# EasyEDA Pro project 小张FOC-STM32G431CBU6.epro, schematic Schematic1
Board Name: 主驱一体_V1.1; Create Date: 2024-09-16; Page Name: P1; Project Name: 小张FOC-STM32G431CBU6; Schematic Name: Schematic1; Update Date: 2024-11-04; Company: 嘉立创EDA; Page Size: A3; Version: V1.0
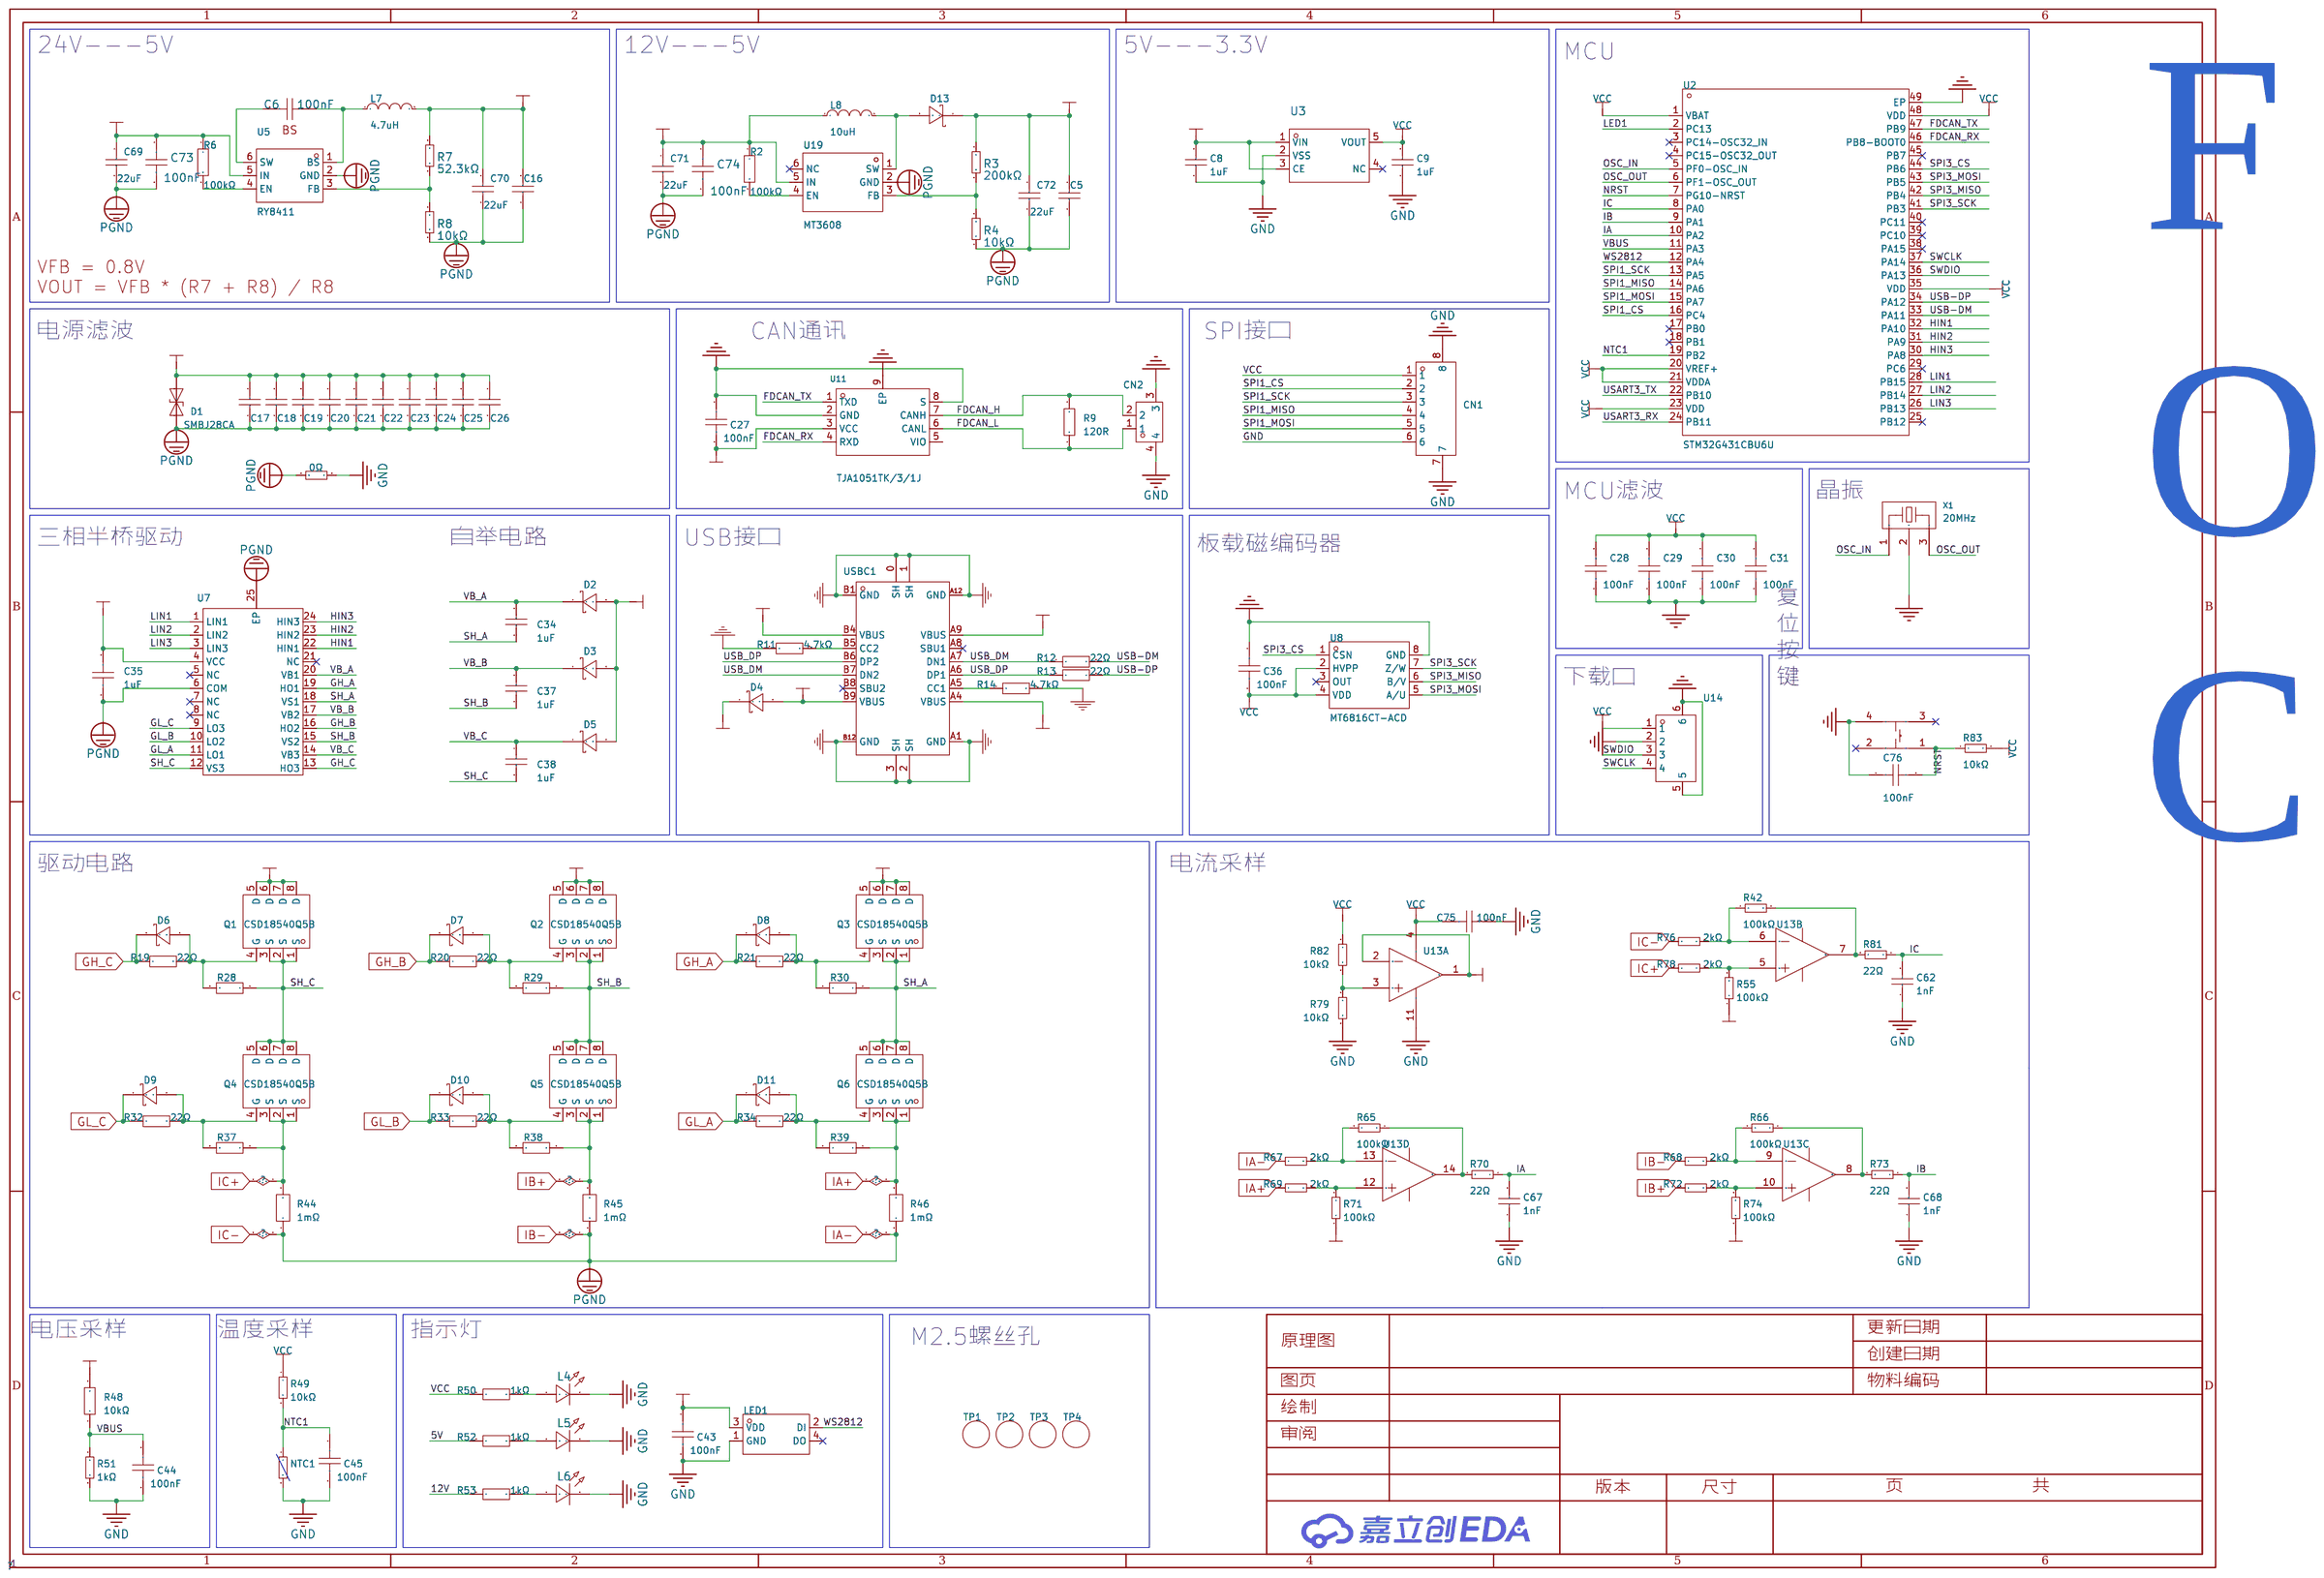
[diagram p4: schematic sheet]

## Parts
C5  100nF  [C0603_SMALL]
C6  100nF  [C0603_SMALL]
C8  1uF  [C0603_SMALL]
C9  1uF  [C0603_SMALL]
C16  100nF  [C0603_SMALL]
C17  10uF  [C1206_SMALL]
C18  10uF  [C1206_SMALL]
C19  10uF  [C1206_SMALL]
C20  10uF  [C1206_SMALL]
C21  10uF  [C1206_SMALL]
C22  10uF  [C1206_SMALL]
C23  10uF  [C1206_SMALL]
C24  10uF  [C1206_SMALL]
C25  10uF  [C1206_SMALL]
C26  10uF  [C1206_SMALL]
C27  100nF  [C0603_SMALL]
C28  100nF  [C0603_SMALL]
C29  100nF  [C0603_SMALL]
C30  100nF  [C0603_SMALL]
C31  100nF  [C0603_SMALL]
C34  1uF  [C0603_SMALL]
C35  1uF  [C0805_SMALL]
C36  100nF  [C0603_SMALL]
C37  1uF  [C0603_SMALL]
C38  1uF  [C0603_SMALL]
C43  100nF  [C0603_SMALL]
C44  100nF  [C0603_SMALL]
C45  100nF  [C0603_SMALL]
C62  1nF  [C0603_S]
C67  1nF  [C0603_S]
C68  1nF  [C0603_S]
C69  22uF  [C1206_SMALL]
C70  22uF  [C1206_SMALL]
C71  22uF  [C1206_SMALL]
C72  22uF  [C1206_SMALL]
C73  100nF  [C0603_SMALL]
C74  100nF  [C0603_SMALL]
C75  100nF  [C0603_SMALL]
C76  100nF  [C0603_SMALL]
CN1  WAFER-GH1.25-6PWB  [CONN-SMD_6P-P1.25_XUNPU_WAFER-GH1.25-6PWB]
CN2  X1251WRS-02HF-LPSW  [CONN-SMD_2P-P1.25_X1251WRS-02HF-LPSW]
D1  SMBJ28CA  [SMB_L4.6-W3.6-LS5.3-BI]
D2  B16WS  [SOD-323_L1.8-W1.3-LS2.5-RD]
D3  B16WS  [SOD-323_L1.8-W1.3-LS2.5-RD]
D4  B16WS  [SOD-323_L1.8-W1.3-LS2.5-RD]
D5  B16WS  [SOD-323_L1.8-W1.3-LS2.5-RD]
D6  B16WS  [SOD-323_L1.8-W1.3-LS2.5-RD]
D7  B16WS  [SOD-323_L1.8-W1.3-LS2.5-RD]
D8  B16WS  [SOD-323_L1.8-W1.3-LS2.5-RD]
D9  B16WS  [SOD-323_L1.8-W1.3-LS2.5-RD]
D10  B16WS  [SOD-323_L1.8-W1.3-LS2.5-RD]
D11  B16WS  [SOD-323_L1.8-W1.3-LS2.5-RD]
D13  B16WS  [SOD-323_L1.8-W1.3-LS2.5-RD]
L4  NCD0603R1  [LED0603_S]
L5  NCD0603R1  [LED0603_S]
L6  NCD0603R1  [LED0603_S]
L7  4.7uH  [IND-SMD_L4.0-W4.0_FNR40XXS]
L8  10uH  [IND-SMD_L4.0-W4.0_FNR40XXS]
LED1  XL-3528RGBW-WS2812B  [LED-SMD_4P-L3.5-W2.8-BR-1]
NTC1  NCP18XH103F03RB  [R0603_SMALL]
Q1  CSD18540Q5B  [VSON-CLIP-8_L5.0-W6.0-P1.27-BL]
Q2  CSD18540Q5B  [VSON-CLIP-8_L5.0-W6.0-P1.27-BL]
Q3  CSD18540Q5B  [VSON-CLIP-8_L5.0-W6.0-P1.27-BL]
Q4  CSD18540Q5B  [VSON-CLIP-8_L5.0-W6.0-P1.27-BL]
Q5  CSD18540Q5B  [VSON-CLIP-8_L5.0-W6.0-P1.27-BL]
Q6  CSD18540Q5B  [VSON-CLIP-8_L5.0-W6.0-P1.27-BL]
R2  100kΩ  [R0603_SMALL]
R3  200kΩ  [R0603_SMALL]
R4  10kΩ  [R0603_SMALL]
R6  100kΩ  [R0603_SMALL]
R7  52.3kΩ  [R0603_SMALL]
R8  10kΩ  [R0603_SMALL]
R9  120R  [R0603_SMALL]
R10  0Ω  [R0603_SMALL]
R11  4.7kΩ  [R0603_SMALL]
R12  22Ω  [R0603_SMALL]
R13  22Ω  [R0603_SMALL]
R14  4.7kΩ  [R0603_SMALL]
R19  22Ω  [R0603_SMALL]
R20  22Ω  [R0603_SMALL]
R21  22Ω  [R0603_SMALL]
R28  10kΩ  [R0603_SMALL]
R29  10kΩ  [R0603_SMALL]
R30  10kΩ  [R0603_SMALL]
R32  22Ω  [R0603_SMALL]
R33  22Ω  [R0603_SMALL]
R34  22Ω  [R0603_SMALL]
R37  10kΩ  [R0603_SMALL]
R38  10kΩ  [R0603_SMALL]
R39  10kΩ  [R0603_SMALL]
R42  100kΩ  [R0603_S]
R44  1mΩ  [RES-SMD_L6.4-W3.2_LR2512D-3W-1MR]
R45  1mΩ  [RES-SMD_L6.4-W3.2_LR2512D-3W-1MR]
R46  1mΩ  [RES-SMD_L6.4-W3.2_LR2512D-3W-1MR]
R48  10kΩ  [R0603_SMALL]
R49  10kΩ  [R0603_SMALL]
R50  1kΩ  [R0603_SMALL]
R51  1kΩ  [R0603_SMALL]
R52  1kΩ  [R0603_SMALL]
R53  1kΩ  [R0603_SMALL]
R55  100kΩ  [R0603_S]
R65  100kΩ  [R0603_S]
R66  100kΩ  [R0603_S]
R67  2kΩ  [R0603_S]
R68  2kΩ  [R0603_S]
R69  2kΩ  [R0603_S]
R70  22Ω  [R0603_S]
R71  100kΩ  [R0603_S]
R72  2kΩ  [R0603_S]
R73  22Ω  [R0603_S]
R74  100kΩ  [R0603_S]
R76  2kΩ  [R0603_S]
R78  2kΩ  [R0603_S]
R79  10kΩ  [R0603_S]
R81  22Ω  [R0603_S]
R82  10kΩ  [R0603_S]
R83  10kΩ  [R0603_S]
SW2  SKRPACE010  [KEY-SMD_4P-L4.2-W3.2-P2.20-LS4.6]
TP1  -  [M2.5螺丝孔]
TP2  -  [M2.5螺丝孔]
TP3  -  [M2.5螺丝孔]
TP4  -  [M2.5螺丝孔]
U2  STM32G431CBU6U  [UFQFPN-48_L7.0-W7.0-P0.50-BL-EP5.6]
U3  XC6210B332MR  [SOT-23-5_L3.0-W1.7-P0.95-LS2.8-BR]
U5  RY8411  [SOT-23-6_L2.9-W1.6-P0.95-LS2.8-BL]
U7  FD6288Q  [QFN-24_L4.0-W4.0-P0.50-BL-EP2.6]
U8  MT6816CT-ACD  [SOP-8_L5.0-W4.0-P1.27-LS6.0-BL]
U11  TJA1051TK/3/1J  [HVSON-8_L3.0-W3.0-P0.65-BL-EP]
U13  RS624XQ  [TSSOP-14_L5.0-W4.4-P0.65-LS6.4-BL]  (sections 1,2,3,4)
U14  WAFER-GH1.25-4PWB  [CONN-SMD_4P-P1.25_XUNPU_WAFER-GH1.25-4PWB]
U19  MT3608  [SOT-23-6_L2.9-W1.6-P0.95-LS2.8-BR]
USBC1  TYPE-C-31-M-12  [USB-C_SMD-TYPE-C-31-M-12]
X1  20MHz  [OSC-SMD_3P-L3.2-W1.3-P1.2-L]

## Library data of the parts
C5 C16 = 0603B104K500NT: 容值:100nF;精度:±10%;额定电压:50V;材质(温度系数):X7R;; LCSC Part Name: 100nF ±10% 50V; Supplier Part: C30926; Manufacturer: FH(风华); Supplier Footprint: 0603; JLCPCB Part Class: Extended Part; Datasheet: https://atta.szlcsc.com/upload/public/pdf/source/20200305/C486355_26A10D38EF8C2A5C37091D0039909270.pdf; Supplier: LCSC; Tolerance: ±10%; Voltage Rated: 50V; Temperature Coefficient: X7R; Pin Type: IN; Check: true
C6 C73 C74 = CC0603KRX7R9BB104: 容值:100nF;精度:±10%;额定电压:50V;材质(温度系数):X7R;; LCSC Part Name: 100nF ±10% 50V; Supplier Part: C14663; Manufacturer: YAGEO(国巨); Supplier Footprint: 0603; JLCPCB Part Class: 基础库; Datasheet: https://atta.szlcsc.com/upload/public/pdf/source/20180910/C282072_33301C7F631E79921B82A8DAC6BCC5B3.pdf; Supplier: LCSC; Tolerance: ±10%; Voltage Rated: 50V; Temperature Coefficient: X7R; Check: true
C8 C9 = CL10A106MA8NRNC: 容值:10uF;精度:±20%;额定电压:25V;材质(温度系数):X5R;; LCSC Part Name: 10uF ±20% 25V; Supplier Part: C96446; Manufacturer: SAMSUNG(三星); Supplier Footprint: 0603; JLCPCB Part Class: 基础库; Datasheet: https://atta.szlcsc.com/upload/public/pdf/source/20160218/1457707763339.pdf; Supplier: LCSC; Tolerance: ±20%; Voltage Rated: 25V; Temperature Coefficient: X5R; Pin Type: IN; Check: true
C17-C26 C69-C72 = CL31A106KBHNNNE: 容值:10uF;精度:±10%;额定电压:50V;材质(温度系数):X5R;; LCSC Part Name: 10uF ±10% 50V; Supplier Part: C13585; Manufacturer: SAMSUNG(三星); Supplier Footprint: 1206; JLCPCB Part Class: Basic Part; Datasheet: https://atta.szlcsc.com/upload/public/pdf/source/20160218/1457707763339.pdf; Supplier: LCSC; Tolerance: ±10%; Voltage Rated: 50V; Temperature Coefficient: X5R; Pin Type: IN; 值: 10UF; Check: true
C27-C31 C36 C43-C45 C75 C76 = 0603B104K500NT: 容值:100nF;精度:±10%;额定电压:50V;材质(温度系数):X7R;; LCSC Part Name: 100nF ±10% 50V; Supplier Part: C30926; Manufacturer: FH(风华); Supplier Footprint: 0603; JLCPCB Part Class: Extended Part; Datasheet: https://atta.szlcsc.com/upload/public/pdf/source/20200305/C486355_26A10D38EF8C2A5C37091D0039909270.pdf; Supplier: LCSC; Tolerance: ±10%; Voltage Rated: 50V; Temperature Coefficient: X7R
C34 C37 C38 = C0603_S: Pin Type: IN; Supplier Part: C1604; Check: true
C35 = CL21A106KAYNNNE_C15850: 容值:10uF;精度:±10%;额定电压:25V;材质(温度系数):X5R;; LCSC Part Name: 10uF ±10% 25V; Supplier Part: C15850; Manufacturer: SAMSUNG(三星); Manufacturer Part: CL21A106KAYNNNE; Supplier Footprint: 0805; JLCPCB Part Class: Basic Part; Datasheet: https://atta.szlcsc.com/upload/public/pdf/source/20160103/1457707679302.pdf; Supplier: LCSC; Tolerance: ±10%; Voltage Rated: 25V; Temperature Coefficient: X5R
C62 C67 C68 = 0603B102K500NT: 容值:1nF;精度:±10%;额定电压:50V;材质(温度系数):X7R;; LCSC Part Name: 1nF ±10% 50V; Supplier Part: C44369; Manufacturer: FH(风华); Supplier Footprint: 0603; JLCPCB Part Class: Extended Part; Datasheet: https://atta.szlcsc.com/upload/public/pdf/source/20200305/C486355_26A10D38EF8C2A5C37091D0039909270.pdf; Supplier: LCSC; Tolerance: ±10%; Voltage Rated: 50V; Temperature Coefficient: X7R; Pin Type: IN; Check: true
CN1 = WAFER-GH1.25-6PWB: 参考系列:GH;间距:1.25mm;插针结构:1x6P;排数:1;每排PIN数:6;公母:公型插针;安装方式:卧贴;额定电流:1A;工作温度范围:-25~+85;; LCSC Part Name: GH1.25mm6P卧贴带扣带扣; Supplier Part: C3029381; Manufacturer: XUNPU(讯普); Supplier Footprint: SMD,P=1.25mm; JLCPCB Part Class: ExtendedPart; Datasheet: https://atta.szlcsc.com/upload/public/pdf/source/20220527/CB8773BFB0913C3B8ABD62CB38BA101A.pdf; Supplier: LCSC; Reference Series: GH; Pitch: 1.25mm; Pins Structure: 1x6P; Number of Rows: 1; Number of PINs Per Row: 6; Gender: 公型插针; Mounting Style: 卧贴; Current Rating (Max): 1A; Operating Temperature Range: -25~+85; Check: true
CN2 = X1251WRS-02HF-LPSW: 插针结构:1x2P;间距:1.25mm;安装方式:卧贴;参考系列:GH;总PIN数:2P;排数:1;每排PIN数:2;行距:-;额定电流:1A;触头材质:黄铜;触头镀层:锡;工作温度范围:-;; LCSC Part Name: 1x2P 间距:1.25mm 卧贴 系列:GH; Supplier Part: C388707; Manufacturer: XKB Connection(中国星坤); Supplier Footprint: SMD,P=1.25mm,卧贴; JLCPCB Part Class: 扩展库; Datasheet: https://atta.szlcsc.com/upload/public/pdf/source/20211011/E2F7306AE87519079AD4EC816349A567.pdf; Supplier: LCSC; Pins Structure: 1x2P; Pitch: 1.25mm; Mounting Style: 卧贴; Reference Series: GH; Number of Pins: 2P; Number of Rows: 1; Number of PINs Per Row: 2; Current Rating (Max): 1A; Contact Material: 黄铜; Contact Plating: 锡
D1 = SMBJ28CA: 反向截止电压(Vrwm):28V;最大钳位电压:45.4V;峰值脉冲电流(Ipp)@10/1000us:13.2A;击穿电压:31.1V;; Supplier Part: C356756; Manufacturer: JJW(捷捷微); Supplier Footprint: SMB(DO-214AA); JLCPCB Part Class: 扩展库; Datasheet: https://atta.szlcsc.com/upload/public/pdf/source/20190118/C364661_581AFCFF6ECC065E7F89B606E0837F4E.pdf; Supplier: LCSC; Reverse Stand-Off Voltage (Vrwm): 28V; Maximum Clamping Voltage: 45.4V; Peak Pulse Current (Ipp)@10/1000us: 13.2A; Breakdown Voltage: 31.1V; Reverse Leakage Current (Ir): 1uA; Type: TVS
D2 D3 D5 D13 = B16WS_C364278: 直流反向耐压(Vr):40V;平均整流电流(Io):1A;正向压降(Vf):650mV@1A;; Supplier Part: C364278; Manufacturer: MDD; Supplier Footprint: SOD-323; JLCPCB Part Class: Extended Part; Datasheet: https://atta.szlcsc.com/upload/public/pdf/source/20190125/C364278_08C9E980565605CB111C36D3361AA1D7.pdf; Supplier: LCSC; Reverse Voltage (Vr): 40V; Average Rectified Current (Io): 1A; Forward Voltage (Vf@If): 650mV@1A; Check: true
D4 D6-D11 = B16WS_C364278: 直流反向耐压(Vr):60V;平均整流电流(Io):1A;正向压降(Vf):700mV@1A;; Supplier Part: C364278; Manufacturer: MDD; Supplier Footprint: SOD-323; JLCPCB Part Class: Extended Part; Datasheet: https://atta.szlcsc.com/upload/public/pdf/source/20190125/C364278_08C9E980565605CB111C36D3361AA1D7.pdf; Supplier: LCSC; Reverse Voltage (Vr): 60V; Average Rectified Current (Io): 1A; Forward Voltage (Vf@If): 700mV@1A; Check: true
L4-L6 = NCD0603R1_C84263: 发光颜色:红色;功率:65mW;透镜颜色:无色透明;主波长:615nm~630nm;发光强度:80mcd~220mcd;发光角度:130°;工作温度:-30℃~+85℃;; LCSC Part Name: 红灯 0603红灯   正贴; Supplier Part: C84263; Manufacturer: 国星光电; Supplier Footprint: 0603; JLCPCB Part Class: Extended Part; Datasheet: https://atta.szlcsc.com/upload/public/pdf/source/20200820/C84263_DABC6A75E58F576973B407FDBA283D60.pdf; Supplier: LCSC; Emitted Color: 红色; Forward Voltage (VF): 1.6V~2.6V; Forward Current: 20mA; Power Dissipation: 65mW; Lens Color: 无色透明; Dominant Wavelength: 615nm~630nm; Luminous Intensity: 80mcd~220mcd; Viewing Angle: 130°; Operating Temperature: -30℃~+85℃; Check: true
L7 L8 = FNR4018S4R7MT: 电感值:4.7uH;精度:±20%;额定电流:1.8A;饱和电流(Isat):2.2A;; LCSC Part Name: 4.7uH ±20% 2.2A; Supplier Part: C167806; Manufacturer: cjiang(长江微电); Supplier Footprint: SMD,4x4mm; JLCPCB Part Class: 扩展库; Datasheet: https://atta.szlcsc.com/upload/public/pdf/source/20190327/C167925_9EFF0AABC4CA629C2CC95961DBF7D39D.pdf; Supplier: LCSC; Tolerance: ±20%; Rated Current: 1.8A; Saturation Current (Isat): 2.2A; DC Resistance (DCR): 117mΩ
LED1 = XL-3528RGBW-WS2812B: 发光颜色:RGB三色;二极管配置:-;主波长:618nm~623nm；520nm~525nm；467nm~472nm;功率:50mW；50mW；45mW;安装方式:正贴;; LCSC Part Name: RGB三色 正贴 幻彩; Supplier Part: C2890364; Manufacturer: XINGLIGHT(成兴光); Supplier Footprint: SMD3528-4P; JLCPCB Part Class: 扩展库; Datasheet: https://atta.szlcsc.com/upload/public/pdf/source/20221102/50F456983F591359B0D81AA557777463.pdf; Supplier: LCSC; Emitted Color: RGB三色; Dominant Wavelength: 618nm~623nm；520nm~525nm；467nm~472nm; Peak Wavelength: 525nm；623nm；472nm; Forward Current: 20mA; Power Dissipation: 50mW；50mW；45mW; Viewing Angle: 120°; Mounting Sytle: 正贴; Operating Temperature: -25℃~+80℃; Check: true
NTC1 = NCP18XH103F03RB: 阻值(25℃):10kΩ;电阻精度:±1%;B值精度:±1%;B值(25℃/50℃):3380K;功率:100mW;最大稳态电流(25℃):310uA;B值(25℃/75℃):-;B值(25℃/85℃):3334K;B值(25℃/100℃):3455K;工作温度:-40℃~+125℃;; LCSC Part Name: 10kΩ 电阻精度:±1% 3380K; Supplier Part: C13564; Manufacturer: muRata(村田); Supplier Footprint: 0603; JLCPCB Part Class: Extended Part; Supplier: LCSC; Resistance @ 25℃: 10kΩ; Resistance Tolerance: ±1%; B Constant Tolerance: ±1%; B Constant (25℃/50℃): 3380K; Power: 100mW; Steady State Current (Max): 310uA; B Constant (25℃/85℃): 3334K; B Constant (25℃/100℃): 3455K; Operating Temperature: -40℃~+125℃; Pin Type: IN; Check: true
Q1-Q6 = CSD18540Q5B: 类型:1个N沟道;漏源电压(Vdss):60V;连续漏极电流(Id):100A;功率(Pd):3.1W；195W;导通电阻(RDS(on)@Vgs,Id):2.2mΩ@10V,28A;阈值电压(Vgs(th)@Id):2.3V@250uA;; LCSC Part Name: 1个N沟道 耐压:60V 电流:100A; Supplier Part: C86513; Manufacturer: TI(德州仪器); Supplier Footprint: VSON-8(5x6); JLCPCB Part Class: 扩展库; Datasheet: https://www.ti.com/cn/lit/gpn/csd18540q5b; Supplier: LCSC; Type: 1个N沟道; Drain Source Voltage (Vdss): 60V; Continuous Drain Current (Id): 100A; Power Dissipation (Pd): 3.1W；195W; Drain Source On Resistance (RDS(on)@Vgs,Id): 2.2mΩ@10V,28A; Gate Threshold Voltage (Vgs(th)@Id): 2.3V@250uA; Total Gate Charge (Qg@Vgs): 53nC@10V; Input Capacitance (Ciss@Vds): 4.23nF@30V; Operating Temperature: -55℃~+150℃@(Tj)
R2 R6 = 0603WAF1003T5E: 电阻类型:厚膜电阻;阻值:100kΩ;精度:±1%;功率:100mW;最大工作电压:75V;温度系数:±100ppm/℃;; LCSC Part Name: 100kΩ ±1% 100mW 厚膜电阻; Supplier Part: C25803; Manufacturer: UNI-ROYAL(厚声); Supplier Footprint: 0603; JLCPCB Part Class: 基础库; Datasheet: https://atta.szlcsc.com/upload/public/pdf/source/20200306/C422600_1E6D84923E4A46A82E41ADD87F860B5C.pdf; Supplier: LCSC; Type: 厚膜电阻; Tolerance: ±1%; Power(Watts): 100mW; Overload Voltage (Max): 75V; Temperature Coefficient: ±100ppm/℃; Operating Temperature Range: -55℃~+155℃
R3 R7 = 0603WAF6202T5E: 阻值:62kΩ;精度:±1%;功率:100mW;温度系数:±100ppm/℃;电阻类型:厚膜电阻;; LCSC Part Name: 62kΩ ±1% 100mW 厚膜电阻; Supplier Part: C23221; Manufacturer: UNI-ROYAL(厚声); Supplier Footprint: 0603; JLCPCB Part Class: Basic Part; Datasheet: https://atta.szlcsc.com/upload/public/pdf/source/20200306/C422600_1E6D84923E4A46A82E41ADD87F860B5C.pdf; Supplier: LCSC; Tolerance: ±1%; Power(Watts): 100mW; Overload Voltage (Max): 75V; Temperature Coefficient: ±100ppm/℃; Type: 厚膜电阻; Operating Temperature Range: -55℃~+155℃; Pin Type: IN; 美岩编码: A00010; 单价: 0.009222; Check: true
R4 R8 = 0603WAF1202T5E: 阻值:12kΩ;精度:±1%;功率:100mW;温度系数:±100ppm/℃;电阻类型:厚膜电阻;; LCSC Part Name: 12kΩ ±1% 100mW 厚膜电阻; Supplier Part: C22790; Manufacturer: UNI-ROYAL(厚声); Supplier Footprint: 0603; JLCPCB Part Class: Basic Part; Datasheet: https://atta.szlcsc.com/upload/public/pdf/source/20200306/C422600_1E6D84923E4A46A82E41ADD87F860B5C.pdf; Supplier: LCSC; Tolerance: ±1%; Power(Watts): 100mW; Overload Voltage (Max): 75V; Temperature Coefficient: ±100ppm/℃; Type: 厚膜电阻; Operating Temperature Range: -55℃~+155℃; Pin Type: IN; 美岩编码: A00010; 单价: 0.009222; Check: true
R9 = Res_0603: Supplier Footprint: 0603
R10 = RS-03000FT: 阻值:0Ω;精度:±1%;功率:100mW;; LCSC Part Name: 0Ω ±1% 100mW; Supplier Part: C136582; Manufacturer: FH(风华); Supplier Footprint: 0603; JLCPCB Part Class: Extended Part; Datasheet: https://atta.szlcsc.com/upload/public/pdf/source/20171106/C136582_15099532019501092527.pdf; Supplier: LCSC; Tolerance: ±1%; Power(Watts): 100mW; Overload Voltage (Max): 50V; Operating Temperature Range: -55℃~+155℃; Pin Type: IN; Check: true
R11 R14 R50 R52 R53 = 0603WAF4701T5E: 电阻类型:厚膜电阻;阻值:4.7kΩ;精度:±1%;功率:100mW;最大工作电压:75V;温度系数:±100ppm/℃;; LCSC Part Name: 4.7kΩ ±1% 100mW 厚膜电阻; Supplier Part: C23162; Manufacturer: UNI-ROYAL(厚声); Supplier Footprint: 0603; JLCPCB Part Class: 基础库; Datasheet: https://atta.szlcsc.com/upload/public/pdf/source/20200306/C422600_1E6D84923E4A46A82E41ADD87F860B5C.pdf; Supplier: LCSC; Type: 厚膜电阻; Tolerance: ±1%; Power(Watts): 100mW; Overload Voltage (Max): 75V; Temperature Coefficient: ±100ppm/℃; Operating Temperature Range: -55℃~+155℃
R12 R13 = 0603WAF220JT5E: 电阻类型:厚膜电阻;阻值:22Ω;精度:±1%;功率:100mW;最大工作电压:75V;温度系数:±100ppm/℃;; LCSC Part Name: 22Ω ±1% 100mW 厚膜电阻; Supplier Part: C23345; Manufacturer: UNI-ROYAL(厚声); Supplier Footprint: 0603; JLCPCB Part Class: 基础库; Datasheet: https://atta.szlcsc.com/upload/public/pdf/source/20200306/C422600_1E6D84923E4A46A82E41ADD87F860B5C.pdf; Supplier: LCSC; Type: 厚膜电阻; Tolerance: ±1%; Power(Watts): 100mW; Overload Voltage (Max): 75V; Temperature Coefficient: ±100ppm/℃; Operating Temperature Range: -55℃~+155℃
R19-R21 R32-R34 R70 R73 R81 = 0603WAF220JT5E: 电阻类型:厚膜电阻;阻值:22Ω;精度:±1%;功率:100mW;最大工作电压:75V;温度系数:±100ppm/℃;; LCSC Part Name: 22Ω ±1% 100mW 厚膜电阻; Supplier Part: C23345; Manufacturer: UNI-ROYAL(厚声); Supplier Footprint: 0603; JLCPCB Part Class: 基础库; Datasheet: https://atta.szlcsc.com/upload/public/pdf/source/20200306/C422600_1E6D84923E4A46A82E41ADD87F860B5C.pdf; Supplier: LCSC; Type: 厚膜电阻; Tolerance: ±1%; Power(Watts): 100mW; Overload Voltage (Max): 75V; Temperature Coefficient: ±100ppm/℃; Operating Temperature Range: -55℃~+155℃; Pin Type: IN; Check: true
R28-R30 R37-R39 R49 = 0603WAF1002T5E: 阻值:10kΩ;精度:±1%;功率:100mW;温度系数:±100ppm/℃;电阻类型:厚膜电阻;; LCSC Part Name: 10kΩ ±1% 100mW 厚膜电阻; Supplier Part: C25804; Manufacturer: UNI-ROYAL(厚声); Supplier Footprint: 0603; JLCPCB Part Class: Basic Part; Datasheet: https://atta.szlcsc.com/upload/public/pdf/source/20200306/C422600_1E6D84923E4A46A82E41ADD87F860B5C.pdf; Supplier: LCSC; Tolerance: ±1%; Power(Watts): 100mW; Overload Voltage (Max): 75V; Temperature Coefficient: ±100ppm/℃; Type: 厚膜电阻; Operating Temperature Range: -55℃~+155℃; Pin Type: IN; Check: true
R42 R55 R65 R66 R71 R74 R79 R82 R83 = RT0603BRD0720KL: 电阻类型:薄膜电阻;阻值:20kΩ;精度:±0.1%;功率:100mW;; LCSC Part Name: 20kΩ ±0.1% 100mW; Supplier Part: C723637; Manufacturer: YAGEO(国巨); Supplier Footprint: 0603; JLCPCB Part Class: Extended Part; Datasheet: https://atta.szlcsc.com/upload/public/pdf/source/20200814/C723637_57E5E8B3C02F5D5BA42E401EB3E82C8B.pdf; Supplier: LCSC; Type: 薄膜电阻; Tolerance: ±0.1%; Power(Watts): 100mW; Temperature Coefficient: ±25ppm/℃; Overload Voltage (Max): 75V; Operating Temperature Range: -55℃~+155℃; Pin Type: IN; Check: true
R44-R46 = LR2512D-3W-1mR-1%: 电阻类型:采样电阻;阻值:1mΩ;精度:±1%;功率:3W;温度系数:25ppm/℃~+50ppm/℃;安装方式:贴片;; LCSC Part Name: 1mΩ ±1% 3W; Supplier Part: C500734; Manufacturer: Milliohm(毫欧); Supplier Footprint: 2512; JLCPCB Part Class: 扩展库; Datasheet: https://atta.szlcsc.com/upload/public/pdf/source/20211008/27BCB003066C6550DC06C87D8395239C.pdf; Supplier: LCSC; Type: 采样电阻; Tolerance: ±1%; Power(Watts): 3W; Temperature Coefficient: 25ppm/℃~+50ppm/℃; Mounting Sytle: 贴片
R48 = RC0603FR-0711KL: 电阻类型:厚膜电阻;阻值:11kΩ;精度:±1%;功率:100mW;最大工作电压:75V;温度系数:±100ppm/℃;; LCSC Part Name: 厚膜电阻 11kΩ ±1% 100mW; Supplier Part: C137801; Manufacturer: YAGEO(国巨); Supplier Footprint: 0603; JLCPCB Part Class: 扩展库; Datasheet: https://atta.szlcsc.com/upload/public/pdf/source/20180821/C275644_0D56F95EFF785E7D9A1FEF436B37DA78.pdf; Supplier: LCSC; Type: 厚膜电阻; Tolerance: ±1%; Power(Watts): 100mW; Overload Voltage (Max): 75V; Temperature Coefficient: ±100ppm/℃; Operating Temperature Range: -55℃~+155℃
R51 = RC0603FR-071KL: 电阻类型:厚膜电阻;阻值:1kΩ;精度:±1%;功率:100mW;; LCSC Part Name: 1kΩ ±1% 100mW; Supplier Part: C22548; Manufacturer: YAGEO(国巨); Supplier Footprint: 0603; JLCPCB Part Class: Extended Part; Datasheet: https://atta.szlcsc.com/upload/public/pdf/source/20180312/7BD3618A8B6324EA6280B0497A051AB7.pdf; Supplier: LCSC; Type: 厚膜电阻; Tolerance: ±1%; Power(Watts): 100mW; Temperature Coefficient: ±100ppm/℃; Overload Voltage (Max): 75V; Operating Temperature Range: -55℃~+155℃; Pin Type: IN; Check: true
R67-R69 R72 R76 R78 = RT0603BRD071KL: 电阻类型:薄膜电阻;阻值:1kΩ;精度:±0.1%;功率:100mW;; LCSC Part Name: 1kΩ ±0.1% 100mW; Supplier Part: C110776; Manufacturer: YAGEO(国巨); Supplier Footprint: 0603; JLCPCB Part Class: Extended Part; Datasheet: https://atta.szlcsc.com/upload/public/pdf/source/20170704/1499151282044.pdf; Supplier: LCSC; Type: 薄膜电阻; Tolerance: ±0.1%; Power(Watts): 100mW; Temperature Coefficient: ±25ppm/℃; Overload Voltage (Max): 75V; Operating Temperature Range: -55℃~+155℃; Pin Type: IN; Check: true
SW2 = SKRPACE010: 电路结构:单刀单掷;按钮形状:椭圆形按钮;安装方式:立贴;开关长度:4.2mm;开关宽度:3.2mm;开关高度:2.5mm;触点电流:50mA;额定电压(DC):16V;带灯:-;机械寿命:-;; LCSC Part Name: 4.2*3.2*2.5mm 立贴 轻触开关; Supplier Part: C139797; Manufacturer: ALPSALPINE(阿尔卑斯阿尔派); Supplier Footprint: SMD; Datasheet: https://atta.szlcsc.com/upload/public/pdf/source/20171113/C139797_15105612676371115729.pdf; Supplier: LCSC; Circuit: 单刀单掷; Actuator Style: 椭圆形按钮; Mounting Style: 立贴; Switch Length: 4.2mm; Switch Width: 3.2mm; Switch Height: 2.5mm; Contact Current: 50mA; Voltage Rating (DC): 16V
TP1-TP4 = M2.5螺丝孔: _: 3
U2 = STM32G431CBU6U: CPU内核:CM4;程序存储容量:128KB;RAM总容量:32KB;GPIO端口数量:42;工作电压范围:1.71V~3.6V;CPU最大主频:170MHz;程序存储器类型:FLASH;; Supplier Part: C1341712; Manufacturer: ST(意法半导体); Supplier Footprint: UFQFPN-48(7x7); JLCPCB Part Class: 扩展库; Datasheet: https://atta.szlcsc.com/upload/public/pdf/source/20210607/F3CD0646E5D00AAFDE875C196C2D7333.pdf; Supplier: LCSC; CPU Core: CM4; Program Storage Size: 128KB; RAM Size: 32KB; GPIO Ports Number: 42; Operating Voltage Range: 1.71V~3.6V; CPU Maximum Speed: 170MHz; Program Memory Type: FLASH; Operating Temperature Range: -40℃~+85℃; ADC (Bit): 12bit; DAC (Bit): 12bit; Peripheral/Function: PWM；PWM; Internal Oscillator: 有
U3 = XC6210B332MR_C424705: 输出类型:固定;输出极性:正;最大输入电压:6V;输出电压:3.3V;输出电流:900mA;电源纹波抑制比(PSRR):60dB@(1kHz);; Supplier Part: C424705; Manufacturer: TOREX(特瑞仕); Supplier Footprint: SOT-25; JLCPCB Part Class: Extended Part; Datasheet: https://atta.szlcsc.com/upload/public/pdf/source/20190903/C424705_1DFB2113A9A78D399905DBF688657204.pdf; Supplier: LCSC; Output Type: 固定; Output Polarity: 正; Number of Outputs: 1; Maximum Input Voltage: 6V; Output Voltage: 3.3V; Dropout Voltage: 75mV@(100mA); Output Current: 900mA; Power Supply Rejection Ratio (PSRR): 60dB@(1kHz); Power Supply Rejection Ratio (PRSS): 90dB@(100Hz),60dB@(100kHz); Check: true
U5 = RY8411: Supplier Part: C9900000347; Supplier Footprint: SOT-23-6; JLCPCB Part Class: 扩展库; Supplier: LCSC
U7 = FD6288Q: Supplier Part: C328453; Manufacturer: Fortior Tech(峰岹); Supplier Footprint: QFN-24-EP(4x4); JLCPCB Part Class: 扩展库; Datasheet: https://atta.szlcsc.com/upload/public/pdf/source/20181108/C328453_785547738DB9FC0123219FC22539EFAD.pdf; Supplier: LCSC; Check: true
U8 = MT6816CT-ACD: AB=1024线，Z=4LSB，PWM=1KHz; LCSC Part Name: 零延迟磁角位置传感器IC; Supplier Part: C879560; Manufacturer: MagnTek(麦歌恩); Supplier Footprint: SOP-8; JLCPCB Part Class: 扩展库; Datasheet: https://atta.szlcsc.com/upload/public/pdf/source/20201027/C879560_21F27A21E71569DDEA564795613A647F.pdf; Supplier: LCSC
U11 = TJA1051TK/3/1J: Supplier Part: C2875699; Manufacturer: NXP(恩智浦); Supplier Footprint: HVSON-8-EP(3x3); JLCPCB Part Class: 扩展库; Datasheet: https://atta.szlcsc.com/upload/public/pdf/source/20210128/C2671135_A82E49CDEFC20634F2534E8F261E286A.pdf; Supplier: LCSC
U13 = RS624XQ: 放大器数:四路;增益带宽积(GBP):7MHz;输入偏置电流(Ib):1pA;压摆率(SR):3.7V/us;带宽(-3db):-;轨到轨:-;; LCSC Part Name: 低噪声运放RS624XQ; Supplier Part: C237013; Manufacturer: RUNIC(润石); Supplier Footprint: TSSOP-14; JLCPCB Part Class: 扩展库; Datasheet: https://atta.szlcsc.com/upload/public/pdf/source/20180629/C237016_AF7FD780DD44CC08B5D0D5C046C0F0AE.pdf; Supplier: LCSC; Number of Circuits: 4; Gain Bandwidth Product(GBP): 1.1MHz; Current - Input Bias(Ib): 1pA; Slew Rate(SR): 0.5V/us; Output Current: 55mA; Rail to Rail: 轨到轨; Operating Temperature: -40℃~+125℃; Check: true
U14 = WAFER-GH1.25-4PWB: 插针结构:1x4P;间距:1.25mm;安装方式:卧贴;参考系列:GH;总PIN数:4P;排数:1;每排PIN数:4;额定电流:1A;工作温度范围:-25℃~+85℃;; LCSC Part Name: 1x4P 间距:1.25mm 卧贴 系列:GH; Supplier Part: C3029379; Manufacturer: XUNPU(讯普); Supplier Footprint: SMD,P=1.25mm,卧贴; JLCPCB Part Class: 扩展库; Datasheet: https://atta.szlcsc.com/upload/public/pdf/source/20220527/CB8773BFB0913C3B8ABD62CB38BA101A.pdf; Supplier: LCSC; Pins Structure: 1x4P; Pitch: 1.25mm; Mounting Style: 卧贴; Reference Series: GH; Number of Pins: 4P; Number of Rows: 1; Number of PINs Per Row: 4; Current Rating (Max): 1A; Operating Temperature Range: -25℃~+85℃
U19 = MT3608: 功能类型:升压型;同步整流:-;输出通道数:1;拓扑结构:升压式;输入电压:2V~24V;输出电压:28V;输出电流(最大值):-;开关频率:1.2MHz;; LCSC Part Name: 升压型 2V~24V 1.2MHz; Supplier Part: C84817; Manufacturer: 西安航天民芯; Supplier Footprint: SOT-23-6; JLCPCB Part Class: 扩展库; Datasheet: https://atta.szlcsc.com/upload/public/pdf/source/20161110/1478743351706.pdf; Supplier: LCSC; Function: 升压型; Number of Outputs: 1; Topology: 升压式; Input Voltage: 2V~24V; Output Voltage: 28V; Switching Frequency: 1.2MHz
USBC1 = TYPE-C-31-M-12: 连接器类型:Type-C;标准:-;公母:母;端口数量:1;触点数量:16P;安装方式:-;额定电流 - 电源:5A;触头材质:-;触头镀层:-;工作温度范围:-;焊接温度(最大值):-;; LCSC Part Name: Type-C 母; Supplier Part: C165948; Manufacturer: 韩国韩荣; Supplier Footprint: SMD; JLCPCB Part Class: 扩展库; Datasheet: https://atta.szlcsc.com/upload/public/pdf/source/20220525/466408E853115E789EDB0DDC29077C05.pdf; Supplier: LCSC; Connector Type: Type-C; Gender: 母; Number of Ports: 1; Number of Contacts: 16P; Current Rating - Power (Max): 5A
X1 = CSTCE8M00G52-R0: 频率:8MHz;内置负载电容:10pF;谐振阻抗:40Ω;; LCSC Part Name: 8MHz ±0.5% 内置负载电容:10pF; Supplier Part: C22549; Manufacturer: muRata(村田); Supplier Footprint: SMD3213-3P; JLCPCB Part Class: 扩展库; Datasheet: https://atta.szlcsc.com/upload/public/pdf/source/20160120/1457707754326.pdf; Supplier: LCSC; Built-in Load Capacitance: 10pF; Resonant Impedance: 40Ω; Operating Temperature: -20℃~+80℃

## Nets
5V: C8.2 C16.1 C27.2 C43.1 C70.1 C71.1 C74.1 D4.1 L7.2 L8.1 LED1.3(VDD) R2.1 R7.1 R52.1 U3.1(VIN) U3.3(CE) U11.3(VCC) U19.5(IN)
12V: C5.1 C35.2 C72.1 D2.2 D3.2 D5.2 D13.1 R3.1 R53.1 U7.4(VCC)
GND: C8.1 C9.1 C27.1 C28.1 C29.1 C30.1 C31.1 C36.1 C43.2 C44.2 C45.2 C62.1 C67.1 C68.1 C75.2 C76.1 CN1.6 CN1.7 CN1.8 CN2.3 CN2.4 L4.2 L5.2 L6.2 LED1.1(GND) NTC1.2 R10.2 R11.1 R14.2 R51.2 R79.1 SW2.4 U2.49(EP) U3.2(VSS) U8.8(GND) U11.2(GND) U11.8(S) U11.9(EP) U13.11(V-) U14.2 U14.5 U14.6 USBC1.0(SH) USBC1.1(SH) USBC1.2(SH) USBC1.3(SH) USBC1.A1(GND) USBC1.A12(GND) USBC1.B1(GND) USBC1.B12(GND) X1.2
PGND: C5.2 C16.2 C17.2 C18.2 C19.2 C20.2 C21.2 C22.2 C23.2 C24.2 C25.2 C26.2 C35.1 C69.2 C70.2 C71.2 C72.2 C73.2 C74.2 D1.2(A) R4.2 R8.2 R10.1 R44.1 R45.1 R46.1 R67.1 R68.1 R76.1 U5.2(GND) U7.6(COM) U7.25(EP) U19.2(GND)
VBUS: C44.1 R48.1 R51.1 U2.11(PA3)
VCC: C9.2 C28.2 C29.2 C30.2 C31.2 C36.2 C75.1 CN1.1 R49.1 R50.1 R82.2 R83.2 U2.1(VBAT) U2.20(VREF+) U2.21(VDDA) U2.23(VDD) U2.35(VDD) U2.48(VDD) U3.5(VOUT) U8.2(HVPP) U8.4(VDD) U13.4(V+) U14.1
DCBUS: C17.1 C18.1 C19.1 C20.1 C21.1 C22.1 C23.1 C24.1 C25.1 C26.1 C69.1 C73.1 D1.1(K) Q1.5(D) Q1.6(D) Q1.7(D) Q1.8(D) Q2.5(D) Q2.6(D) Q2.7(D) Q2.8(D) Q3.5(D) Q3.6(D) Q3.7(D) Q3.8(D) R6.1 R48.2 U5.5(IN)
FDCAN_H: CN2.2 R9.2 U11.7(CANH)
FDCAN_L: CN2.1 R9.1 U11.6(CANL)
FDCAN_RX: U2.46(PB8-BOOT0) U11.4(RXD)
FDCAN_TX: U2.47(PB9) U11.1(TXD)
GH_A: D8.1 R21.1 U7.19(HO1)
GH_B: D7.1 R20.1 U7.16(HO2)
GH_C: D6.1 R19.1 U7.13(HO3)
GL_A: D11.1 R34.1 U7.11(LO1)
GL_B: D10.1 R33.1 U7.10(LO2)
GL_C: D9.1 R32.1 U7.9(LO3)
HIN1: U2.32(PA10) U7.22(HIN1)
HIN2: U2.31(PA9) U7.23(HIN2)
HIN3: U2.30(PA8) U7.24(HIN3)
IA: C67.2 R70.1 U2.10(PA2)
IA+: Q6.1(S) Q6.2(S) Q6.3(S) R39.1 R46.2 R69.1
IB: C68.2 R73.1 U2.9(PA1)
IB+: Q5.1(S) Q5.2(S) Q5.3(S) R38.1 R45.2 R72.1
IC: C62.2 R81.1 U2.8(PA0)
IC+: Q4.1(S) Q4.2(S) Q4.3(S) R37.1 R44.2 R78.1
LED1: U2.2(PC13)
LIN1: U2.28(PB15) U7.1(LIN1)
LIN2: U2.27(PB14) U7.2(LIN2)
LIN3: U2.26(PB13) U7.3(LIN3)
NRST: C76.2 R83.1 SW2.1 U2.7(PG10-NRST)
NTC1: C45.1 NTC1.1 R49.2 U2.19(PB2)
OSC_IN: U2.5(PF0-OSC_IN) X1.1
OSC_OUT: U2.6(PF1-OSC_OUT) X1.3
SH_A: C34.2 Q3.1(S) Q3.2(S) Q3.3(S) Q6.5(D) Q6.6(D) Q6.7(D) Q6.8(D) R30.1 U7.18(VS1)
SH_B: C37.2 Q2.1(S) Q2.2(S) Q2.3(S) Q5.5(D) Q5.6(D) Q5.7(D) Q5.8(D) R29.1 U7.15(VS2)
SH_C: C38.2 Q1.1(S) Q1.2(S) Q1.3(S) Q4.5(D) Q4.6(D) Q4.7(D) Q4.8(D) R28.1 U7.12(VS3)
SPI1_CS: CN1.2 U2.16(PC4)
SPI1_MISO: CN1.4 U2.14(PA6)
SPI1_MOSI: CN1.5 U2.15(PA7)
SPI1_SCK: CN1.3 U2.13(PA5)
SPI3_CS: U2.44(PB6) U8.1(CSN)
SPI3_MISO: U2.42(PB4) U8.6(B/V)
SPI3_MOSI: U2.43(PB5) U8.5(A/U)
SPI3_SCK: U2.41(PB3) U8.7(Z/W)
SWCLK: U2.37(PA14) U14.4
SWDIO: U2.36(PA13) U14.3
USART3_RX: U2.24(PB11)
USART3_TX: U2.22(PB10)
USB-DM: R12.2 U2.33(PA11)
USB-DP: R13.2 U2.34(PA12)
USB-VBUS: D4.2 USBC1.A4(VBUS) USBC1.A9(VBUS) USBC1.B4(VBUS) USBC1.B9(VBUS)
USB_DM: R12.1 USBC1.A7(DN1) USBC1.B7(DN2)
USB_DP: R13.1 USBC1.A6(DP1) USBC1.B6(DP2)
VB_A: C34.1 D2.1 U7.20(VB1)
VB_B: C37.1 D3.1 U7.17(VB2)
VB_C: C38.1 D5.1 U7.14(VB3)
VREF: R55.1 R71.1 R74.1 U13.1(OUTA) U13.2(-INA)
WS2812: LED1.2(DI) U2.12(PA4)
$1N2033: R11.2 USBC1.B5(CC2)
$1N2034: R14.1 USBC1.A5(CC1)
$1N2854: L5.1 R52.2
$1N2859: R7.2 R8.1 U5.3(FB)
$1N3499: L6.1 R53.2
$1N49622: D6.2 Q1.4(G) R19.2 R28.2
$1N53821: D10.2 Q5.4(G) R33.2 R38.2
$1N53957: D11.2 Q6.4(G) R34.2 R39.2
$1N54089: D7.2 Q2.4(G) R20.2 R29.2
$1N54225: D8.2 Q3.4(G) R21.2 R30.2
$1N55157: R6.2 U5.4(EN)
$1N55174: C6.2 U5.6(SW)
$1N55187: C6.1 L7.1 U5.1(BS)
$1N55724: L4.1 R50.2
$1N81384: D9.2 Q4.4(G) R32.2 R37.2
$1N85731: R3.2 R4.1 U19.3(FB)
$1N85737: R2.2 U19.4(EN)
$1N98309: R42.1 R81.2 U13.7(OUTB)
$1N98311: R55.2 R78.2 U13.5(+INB)
$1N98312: R42.2 R76.2 U13.6(-INB)
$1N98316: R79.2 R82.1 U13.3(+INA)
$1N98323: R66.1 R73.2 U13.8(OUTC)
$1N98325: R72.2 R74.2 U13.10(+INC)
$1N98326: R66.2 R68.2 U13.9(-INC)
$1N98330: R65.1 R70.2 U13.14(OUTD)
$1N98332: R69.2 R71.2 U13.12(+IND)
$1N98333: R65.2 R67.2 U13.13(-IND)
$1N122508: D13.2 L8.2 U19.1(SW)

Not connected (* = marked no-connect by the designer): LED1 4(DO)*; SW2 2* 3*; U2 3(PC14-OSC32_IN)* 4(PC15-OSC32_OUT)* 17(PB0)* 18(PB1)* 25(PB12)* 29(PC6)* 38(PA15)* 39(PC10)* 40(PC11)* 45(PB7)*; U3 4(NC)*; U7 5(NC)* 7(NC)* 8(NC)* 21(NC)*; U8 3(OUT)*; U11 5(VIO); U19 6(NC)*; USBC1 A8(SBU1)* B8(SBU2)*

## Notes on the sheet
- 24V---5V
- 12V---5V
- 5V---3.3V
- MCU
- F
  O
  C
- VFB = 0.8V
- VOUT = VFB * (R7 + R8) / R8
- 电源滤波
- CAN通讯
- SPI接口
- MCU滤波
- 晶振
- 三相半桥驱动
- 自举电路
- USB接口
- 板载磁编码器
- 下载口
- 复
  位
  按
  键
- 驱动电路
- 电流采样
- 电压采样
- 温度采样
- 指示灯
- M2.5螺丝孔
